# EAGLE schematic LED-Cube Platine (EAGLE 9.6.0)
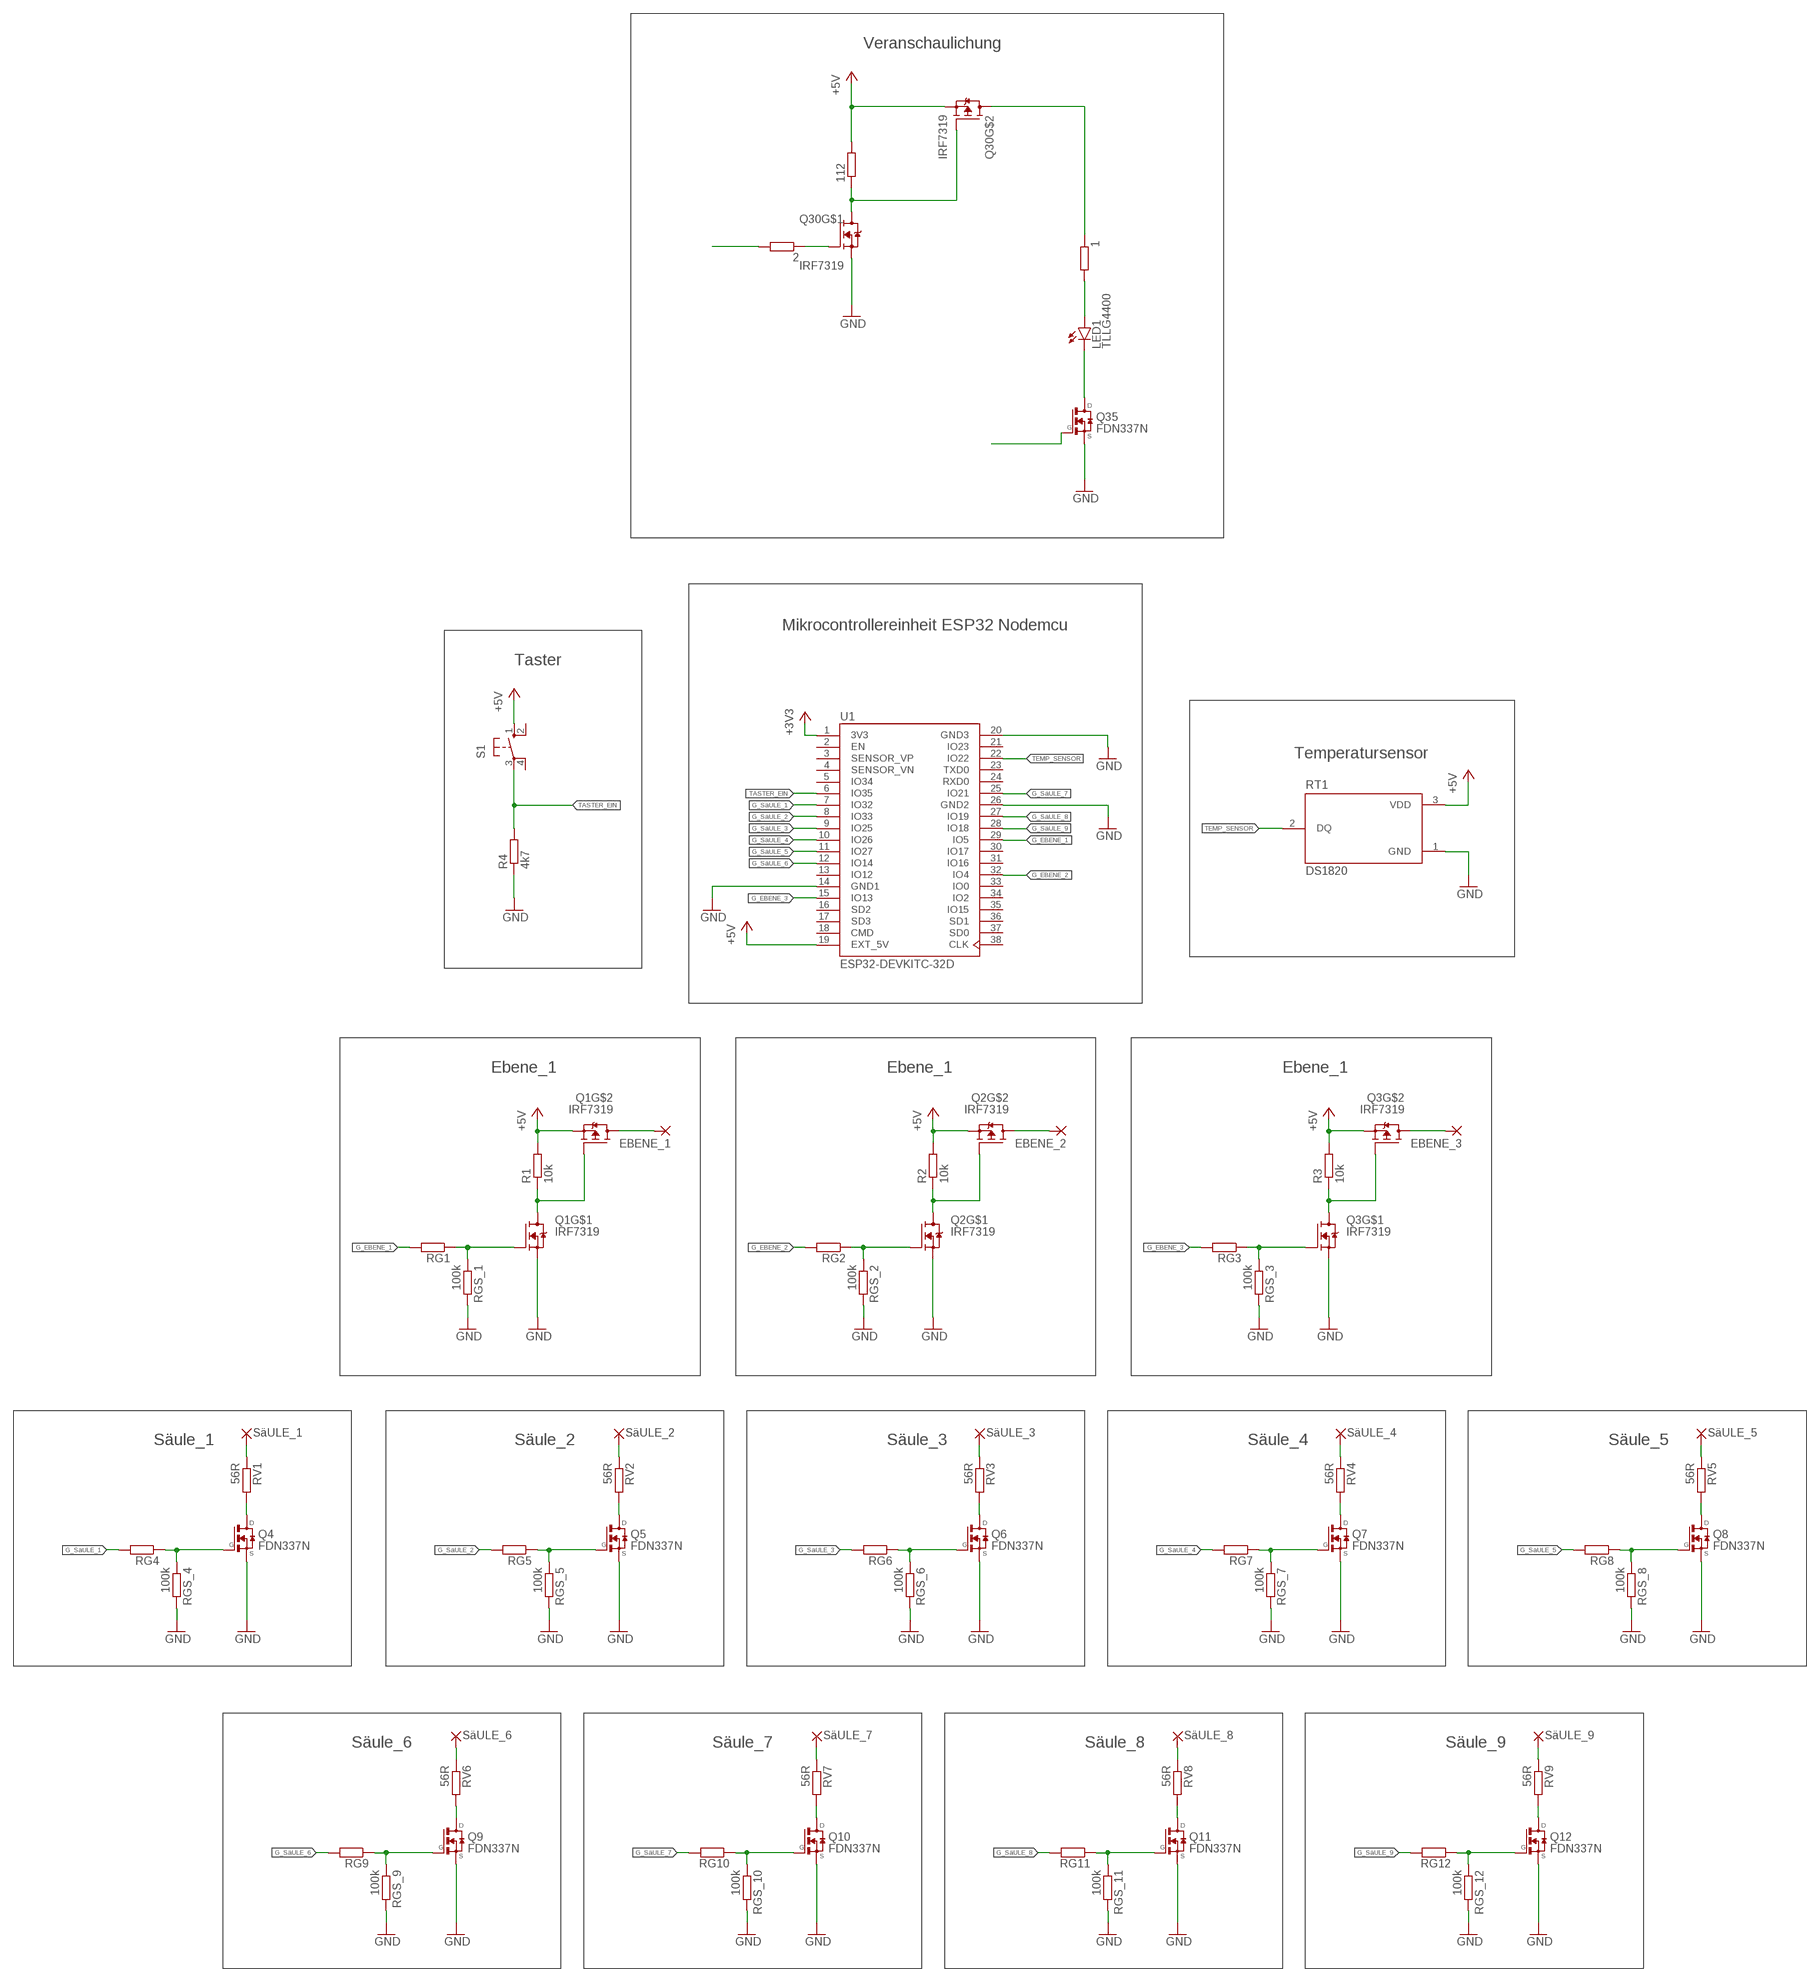
[diagram p0: schematic, sheet 1]

## Parts
1  R-EU_R0805  [R0805]
2  R-EU_R0805  [R0805]
112  R-EU_R0805  [R0805]
EBENE_1  WIREPAD1,6/0,8  [1,6/0,8]
EBENE_2  WIREPAD1,6/0,8  [1,6/0,8]
EBENE_3  WIREPAD1,6/0,8  [1,6/0,8]
LED1  TLLG4400  [LED3MM]
Q1  IRF7319  [SOIC127P600X175-8N]
Q2  IRF7319  [SOIC127P600X175-8N]
Q3  IRF7319  [SOIC127P600X175-8N]
Q4  FDN337N  [SSOT-3]
Q5  FDN337N  [SSOT-3]
Q6  FDN337N  [SSOT-3]
Q7  FDN337N  [SSOT-3]
Q8  FDN337N  [SSOT-3]
Q9  FDN337N  [SSOT-3]
Q10  FDN337N  [SSOT-3]
Q11  FDN337N  [SSOT-3]
Q12  FDN337N  [SSOT-3]
Q30  IRF7319  [SOIC127P600X175-8N]
Q35  FDN337N  [SSOT-3]
R1  10k  R-EU_R0805  [R0805]
R2  10k  R-EU_R0805  [R0805]
R3  10k  R-EU_R0805  [R0805]
R4  4k7  R-EU_R0805  [R0805]
RG1  R-EU_R0805  [R0805]
RG2  R-EU_R0805  [R0805]
RG3  R-EU_R0805  [R0805]
RG4  R-EU_R0805  [R0805]
RG5  R-EU_R0805  [R0805]
RG6  R-EU_R0805  [R0805]
RG7  R-EU_R0805  [R0805]
RG8  R-EU_R0805  [R0805]
RG9  R-EU_R0805  [R0805]
RG10  R-EU_R0805  [R0805]
RG11  R-EU_R0805  [R0805]
RG12  R-EU_R0805  [R0805]
RGS_1  100k  R-EU_R0805  [R0805]
RGS_2  100k  R-EU_R0805  [R0805]
RGS_3  100k  R-EU_R0805  [R0805]
RGS_4  100k  R-EU_R0805  [R0805]
RGS_5  100k  R-EU_R0805  [R0805]
RGS_6  100k  R-EU_R0805  [R0805]
RGS_7  100k  R-EU_R0805  [R0805]
RGS_8  100k  R-EU_R0805  [R0805]
RGS_9  100k  R-EU_R0805  [R0805]
RGS_10  100k  R-EU_R0805  [R0805]
RGS_11  100k  R-EU_R0805  [R0805]
RGS_12  100k  R-EU_R0805  [R0805]
RT1  DS1820  [TO92127P495H695-3]
RV1  56R  R-EU_R0805  [R0805]
RV2  56R  R-EU_R0805  [R0805]
RV3  56R  R-EU_R0805  [R0805]
RV4  56R  R-EU_R0805  [R0805]
RV5  56R  R-EU_R0805  [R0805]
RV6  56R  R-EU_R0805  [R0805]
RV7  56R  R-EU_R0805  [R0805]
RV8  56R  R-EU_R0805  [R0805]
RV9  56R  R-EU_R0805  [R0805]
S1  10-XX  [B3F-10XX]
SäULE_1  WIREPAD1,6/0,8  [1,6/0,8]
SäULE_2  WIREPAD1,6/0,8  [1,6/0,8]
SäULE_3  WIREPAD1,6/0,8  [1,6/0,8]
SäULE_4  WIREPAD1,6/0,8  [1,6/0,8]
SäULE_5  WIREPAD1,6/0,8  [1,6/0,8]
SäULE_6  WIREPAD1,6/0,8  [1,6/0,8]
SäULE_7  WIREPAD1,6/0,8  [1,6/0,8]
SäULE_8  WIREPAD1,6/0,8  [1,6/0,8]
SäULE_9  WIREPAD1,6/0,8  [1,6/0,8]
U1  ESP32-DEVKITC-32D  [MODULE_ESP32-DEVKITC-32D]

## Nets
+3V3: U1.1(3V3)
+5V: 112.2 Q1.3(S2) Q2.3(S2) Q3.3(S2) Q30.3(S2) R1.2 R2.2 R3.2 RT1.3(VDD) S1.1(S) U1.19(EXT_5V)
G_EBENE_1: RG1.2 U1.29(IO5)
G_EBENE_2: RG2.2 U1.32(IO4)
G_EBENE_3: RG3.2 U1.15(IO13)
G_SäULE_1: RG4.2 U1.7(IO32)
G_SäULE_2: RG5.2 U1.8(IO33)
G_SäULE_3: RG6.2 U1.9(IO25)
G_SäULE_4: RG7.2 U1.10(IO26)
G_SäULE_5: RG8.2 U1.11(IO27)
G_SäULE_6: RG9.2 U1.12(IO14)
G_SäULE_7: RG10.2 U1.25(IO21)
G_SäULE_8: RG11.2 U1.27(IO19)
G_SäULE_9: RG12.2 U1.28(IO18)
GND: Q1.1(S1) Q2.1(S1) Q3.1(S1) Q4.2(S) Q5.2(S) Q6.2(S) Q7.2(S) Q8.2(S) Q9.2(S) Q10.2(S) Q11.2(S) Q12.2(S) Q30.1(S1) Q35.2(S) R4.1 RGS_1.2 RGS_2.2 RGS_3.2 RGS_4.2 RGS_5.2 RGS_6.2 RGS_7.2 RGS_8.2 RGS_9.2 RGS_10.2 RGS_11.2 RGS_12.2 RT1.1(GND) U1.14(GND1) U1.20(GND3) U1.26(GND2)
N$1: 112.1 Q30.4(G2) Q30.7(D1) Q30.8(D1)
N$2: 1.1 Q30.5(D2) Q30.6(D2)
N$3: 1.2 LED1.A
N$4: LED1.K(C) Q35.3(D)
N$5: 2.1 Q30.2(G1)
N$6: 2.2
N$7: Q1.2(G1) RG1.1 RGS_1.1
N$8: Q4.3(D) RV1.2
N$9: RV1.1 SäULE_1.1(P)
N$10: Q5.3(D) RV2.2
N$11: RV2.1 SäULE_2.1(P)
N$12: Q6.3(D) RV3.2
N$13: RV3.1 SäULE_3.1(P)
N$14: Q7.3(D) RV4.2
N$15: RV4.1 SäULE_4.1(P)
N$16: Q8.3(D) RV5.2
N$17: Q4.1(G) RG4.1 RGS_4.1
N$18: RV5.1 SäULE_5.1(P)
N$19: Q35.1(G)
N$21: RV6.1 SäULE_6.1(P)
N$22: Q9.3(D) RV6.2
N$23: Q10.3(D) RV7.2
N$24: RV7.1 SäULE_7.1(P)
N$25: Q11.3(D) RV8.2
N$26: RV8.1 SäULE_8.1(P)
N$27: Q12.3(D) RV9.2
N$28: RV9.1 SäULE_9.1(P)
N$29: Q2.2(G1) RG2.1 RGS_2.1
N$30: EBENE_1.1(P) Q1.5(D2) Q1.6(D2)
N$31: Q2.4(G2) Q2.7(D1) Q2.8(D1) R2.1
N$32: Q1.4(G2) Q1.7(D1) Q1.8(D1) R1.1
N$33: EBENE_2.1(P) Q2.5(D2) Q2.6(D2)
N$34: Q5.1(G) RG5.1 RGS_5.1
N$35: Q3.2(G1) RG3.1 RGS_3.1
N$36: Q6.1(G) RG6.1 RGS_6.1
N$37: Q3.4(G2) Q3.7(D1) Q3.8(D1) R3.1
N$38: Q7.1(G) RG7.1 RGS_7.1
N$39: EBENE_3.1(P) Q3.5(D2) Q3.6(D2)
N$40: Q8.1(G) RG8.1 RGS_8.1
N$42: Q9.1(G) RG9.1 RGS_9.1
N$44: Q10.1(G) RG10.1 RGS_10.1
N$46: Q11.1(G) RG11.1 RGS_11.1
N$48: Q12.1(G) RG12.1 RGS_12.1
TASTER_EIN: R4.2 S1.3(P) U1.6(IO35)
TEMP_SENSOR: RT1.2(DQ) U1.22(IO22)
Unconnected: S1.2(S1) S1.4(P1) U1.2(EN) U1.3(SENSOR_VP) U1.4(SENSOR_VN) U1.5(IO34) U1.13(IO12) U1.16(SD2) U1.17(SD3) U1.18(CMD) U1.21(IO23) U1.23(TXD0) U1.24(RXD0) U1.30(IO17) U1.31(IO16) U1.33(IO0) U1.34(IO2) U1.35(IO15) U1.36(SD1) U1.37(SD0) U1.38(CLK)

## Notes on the sheet
- Veranschaulichung
- Mikrocontrollereinheit ESP32 Nodemcu
- Taster
- Temperatursensor
- Ebene_1 | Ebene_1 | Ebene_1
- Säule_1 | Säule_2 | Säule_3 | Säule_4 | Säule_5
- Säule_6 | Säule_7 | Säule_8 | Säule_9

## Library data of the parts
1 2 112 R1-R4 RG1-RG12 RGS_1-RGS_12 RV1-RV9 = rcl:R-EU_: RESISTOR, European symbol; SPICEPREFIX: R
EBENE_1-EBENE_3 SäULE_1-SäULE_9 = wirepad:WIREPAD: Wire PAD connect wire on PCB
LED1 = led:TLLG4400: Low Current (2mA) LED 3 mm Tinted Diffused Package color GREEN Source: Data sheet <http://www.farnell.com/datasheets/391098.pdf>; MF: VISHAY SEMICONDUCTOR; OC_FARNELL: 1612435
Q1-Q3 Q30 = IRF7319:IRF7319: 30V Dual N- and P- Channel HEXFET Power MOSFET in a SO-8 package; AVAILABILITY: Unavailable; DESCRIPTION: Mosfet Array N and P-Channel 30V 2W Surface Mount 8-SO; MF: Infineon Technologies; MP: IRF7319; PACKAGE: SOIC-8 International Rectifier; PRICE: None
Q4-Q12 Q35 = FDN337N:FDN337N: N-Channel MOSFET Logic Level Enhancement Mode Field Effect Transistor; AVAILABILITY: Unavailable; DESCRIPTION: N-Channel 30V 2.2A (Ta) 500mW (Ta) Surface Mount SuperSOT-3; MF: ON Semiconductor; MP: FDN337N; PACKAGE: SC-59 ON Semiconductor; PRICE: None
RT1 = DS1820:DS1820: Temperature Sensor Digital, Local -55°C ~ 125°C 7 b TO-92-3 Check prices <https://pricing.snapeda.com/search/part/DS1820/?ref=eda>; AVAILABILITY: Bad; DESCRIPTION: Temperature Sensor Digital, Local -55°C ~ 125°C 7 b TO-92-3; MF: Maxim Integrated; MP: DS1820; PACKAGE: TO-92 Maxim Integrated; PRICE: None
S1 = switch-omron:10-XX: OMRON SWITCH; MPN: B3F-1000; OC_FARNELL: 176432; OC_NEWARK: 36M3542
U1 = ESP32-DEVKITC-32D:ESP32-DEVKITC-32D: Eval Board For Esp-Wroom-32 Check prices <https://pricing.snapeda.com/search/part/ESP32-DEVKITC-32D/?ref=eda>; AVAILABILITY: Warning; DESCRIPTION: - Transceiver; 802.11 b/g/n (Wi-Fi, WiFi, WLAN), Bluetooth® Smart Ready 4.x Dual Mode For Use With ESP-WROOM-32; MF: Espressif Systems; MP: ESP32-DEVKITC-32D; PACKAGE: None; PRICE: None; PURCHASE-URL: https://pricing.snapeda.com/search/part/ESP32-DEVKITC-32D/?ref=eda